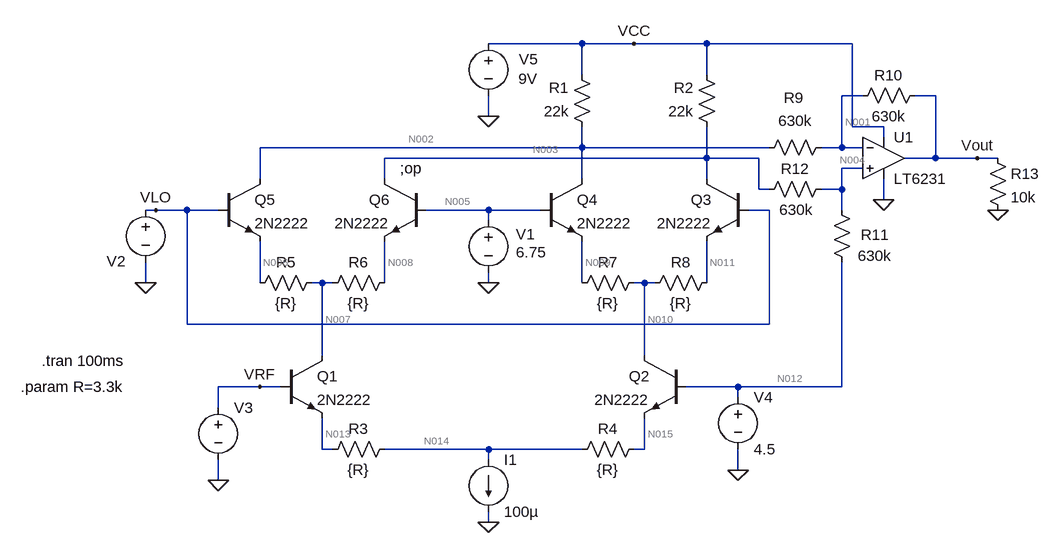
[diagram p0: schematic GilbertCellMultiplier.asc]
GilbertCellMultiplier.asc, the LTspice schematic file:
Version 4
SHEET 1 1116 680
WIRE 352 -416 208 -416
WIRE 432 -416 352 -416
WIRE 544 -416 432 -416
WIRE 768 -416 544 -416
WIRE 352 -368 352 -416
WIRE 544 -368 544 -416
WIRE 784 -336 752 -336
WIRE 896 -336 864 -336
WIRE 208 -304 208 -336
WIRE 768 -288 768 -416
WIRE 816 -288 768 -288
WIRE 816 -272 816 -288
WIRE 352 -256 352 -288
WIRE 352 -256 -144 -256
WIRE 640 -256 352 -256
WIRE 752 -256 752 -336
WIRE 752 -256 720 -256
WIRE 784 -256 752 -256
WIRE 544 -240 544 -288
WIRE 544 -240 48 -240
WIRE 624 -240 544 -240
WIRE 896 -240 896 -336
WIRE 896 -240 848 -240
WIRE 960 -240 896 -240
WIRE 992 -240 960 -240
WIRE 784 -224 752 -224
WIRE -144 -208 -144 -256
WIRE 48 -208 48 -240
WIRE 352 -208 352 -256
WIRE 544 -208 544 -240
WIRE 624 -192 624 -240
WIRE 640 -192 624 -192
WIRE 752 -192 752 -224
WIRE 752 -192 720 -192
WIRE 816 -176 816 -208
WIRE -304 -160 -320 -160
WIRE -256 -160 -304 -160
WIRE -208 -160 -256 -160
WIRE 208 -160 112 -160
WIRE 288 -160 208 -160
WIRE 640 -160 608 -160
WIRE 752 -160 752 -192
WIRE 208 -144 208 -160
WIRE -320 -48 -320 -80
WIRE -144 -48 -144 -112
WIRE -48 -48 -64 -48
WIRE -32 -48 -48 -48
WIRE 48 -48 48 -112
WIRE 208 -48 208 -64
WIRE 352 -48 352 -112
WIRE 448 -48 432 -48
WIRE 464 -48 448 -48
WIRE 544 -48 544 -112
WIRE -256 16 -256 -160
WIRE 640 16 640 -160
WIRE 640 16 -256 16
WIRE -48 64 -48 -48
WIRE 448 64 448 -48
WIRE -144 112 -208 112
WIRE -112 112 -144 112
WIRE 592 112 512 112
WIRE 752 112 752 -80
WIRE 752 112 592 112
WIRE 592 128 592 112
WIRE -208 144 -208 112
WIRE -48 208 -48 160
WIRE -32 208 -48 208
WIRE 208 208 48 208
WIRE 352 208 208 208
WIRE 448 208 448 160
WIRE 448 208 432 208
WIRE 208 224 208 208
WIRE 592 240 592 208
WIRE -208 256 -208 224
WIRE 208 320 208 304
FLAG 208 -48 0
FLAG -320 -48 0
FLAG -208 256 0
FLAG 592 240 0
FLAG 208 -304 0
FLAG 208 320 0
FLAG 816 -176 0
FLAG 960 -240 Vout
FLAG -304 -160 VLO
FLAG -144 112 VRF
FLAG 432 -416 VCC
FLAG 992 -160 0
SYMBOL npn -112 64 R0
SYMATTR InstName Q1
SYMATTR Value 2N2222
SYMBOL npn 512 64 M0
SYMATTR InstName Q2
SYMATTR Value 2N2222
SYMBOL npn 608 -208 M0
SYMATTR InstName Q3
SYMATTR Value 2N2222
SYMBOL npn 288 -208 R0
SYMATTR InstName Q4
SYMATTR Value 2N2222
SYMBOL npn -208 -208 R0
SYMATTR InstName Q5
SYMATTR Value 2N2222
SYMBOL npn 112 -208 M0
SYMATTR InstName Q6
SYMATTR Value 2N2222
SYMBOL res 368 -272 R180
WINDOW 0 36 76 Left 2
WINDOW 3 36 40 Left 2
SYMATTR InstName R1
SYMATTR Value 22k
SYMBOL res 560 -272 R180
WINDOW 0 36 76 Left 2
WINDOW 3 36 40 Left 2
SYMATTR InstName R2
SYMATTR Value 22k
SYMBOL res -48 224 R270
WINDOW 0 32 56 VTop 2
WINDOW 3 0 56 VBottom 2
SYMATTR InstName R3
SYMATTR Value {R}
SYMBOL res 336 224 R270
WINDOW 0 32 56 VTop 2
WINDOW 3 0 56 VBottom 2
SYMATTR InstName R4
SYMATTR Value {R}
SYMBOL res -160 -32 R270
WINDOW 0 32 56 VTop 2
WINDOW 3 0 56 VBottom 2
SYMATTR InstName R5
SYMATTR Value {R}
SYMBOL res -48 -32 R270
WINDOW 0 32 56 VTop 2
WINDOW 3 0 56 VBottom 2
SYMATTR InstName R6
SYMATTR Value {R}
SYMBOL res 336 -32 R270
WINDOW 0 32 56 VTop 2
WINDOW 3 0 56 VBottom 2
SYMATTR InstName R7
SYMATTR Value {R}
SYMBOL res 448 -32 R270
WINDOW 0 32 56 VTop 2
WINDOW 3 0 56 VBottom 2
SYMATTR InstName R8
SYMATTR Value {R}
SYMBOL voltage 208 -160 R0
WINDOW 0 42 37 Left 2
WINDOW 3 42 65 Left 2
WINDOW 123 0 0 Left 2
WINDOW 39 0 0 Left 2
SYMATTR InstName V1
SYMATTR Value 6.75
SYMBOL voltage -320 -176 R0
WINDOW 0 -60 95 Left 2
WINDOW 3 -140 252 Invisible 2
WINDOW 123 0 0 Left 2
WINDOW 39 -60 123 Left 2
SYMATTR InstName V2
SYMATTR Value SINE(6.75 100mV 10Hz)
SYMBOL voltage -208 128 R0
WINDOW 3 -377 96 Invisible 2
WINDOW 123 0 0 Left 2
WINDOW 39 0 0 Left 2
SYMATTR Value SINE(4.5V 200mV 440Hz 0 0 90)
SYMATTR InstName V3
SYMBOL voltage 592 112 R0
WINDOW 123 0 0 Left 2
WINDOW 39 0 0 Left 2
SYMATTR InstName V4
SYMATTR Value 4.5
SYMBOL voltage 208 -432 R0
WINDOW 0 47 40 Left 2
WINDOW 3 46 70 Left 2
WINDOW 123 0 0 Left 2
WINDOW 39 0 0 Left 2
SYMATTR InstName V5
SYMATTR Value 9V
SYMBOL current 208 224 R0
WINDOW 123 0 0 Left 2
WINDOW 39 0 0 Left 2
SYMATTR InstName I1
SYMATTR Value 100µ
SYMBOL Opamps\\LT6231 816 -240 R0
SYMATTR InstName U1
SYMBOL res 736 -272 R90
WINDOW 0 -45 58 VBottom 2
WINDOW 3 -41 56 VTop 2
SYMATTR InstName R9
SYMATTR Value 630k
SYMBOL res 880 -352 R90
WINDOW 0 0 56 VBottom 2
WINDOW 3 32 56 VTop 2
SYMATTR InstName R10
SYMATTR Value 630k
SYMBOL res 768 -64 R180
WINDOW 0 -57 58 Left 2
WINDOW 3 -61 26 Left 2
SYMATTR InstName R11
SYMATTR Value 630k
SYMBOL res 624 -176 R270
WINDOW 0 32 56 VTop 2
WINDOW 3 0 58 VBottom 2
SYMATTR InstName R12
SYMATTR Value 630k
SYMBOL res 976 -256 R0
SYMATTR InstName R13
SYMATTR Value 10k
TEXT -480 72 Left 2 !.tran 100ms
TEXT -512 112 Left 2 !.param R=3.3k
TEXT 72 -224 Left 2 !;op

The netlist it stands for:
* GilbertCellMultiplier.asc
Q1 N007 VRF N013 0 2N2222
Q2 N010 N012 N015 0 2N2222
Q3 N003 VLO N011 0 2N2222
Q4 N002 N005 N009 0 2N2222
Q5 N002 VLO N006 0 2N2222
Q6 N003 N005 N008 0 2N2222
R1 N002 VCC 22k
R2 N003 VCC 22k
R3 N013 N014 {R}
R4 N014 N015 {R}
R5 N006 N007 {R}
R6 N007 N008 {R}
R7 N009 N010 {R}
R8 N010 N011 {R}
V1 N005 0 6.75
V2 VLO 0 SINE(6.75 100mV 10Hz)
V3 VRF 0 SINE(4.5V 200mV 440Hz 0 0 90)
V4 N012 0 4.5
V5 VCC 0 9V
I1 N014 0 100µ
XU1 N004 N001 Vout VCC 0 LT6231  ; pins In+ In- OUT V+ V-
R9 N001 N002 630k
R10 Vout N001 630k
R11 N012 N004 630k
R12 N003 N004 630k
R13 Vout 0 10k
.model NPN NPN
.model PNP PNP
.lib standard.bjt
.tran 100ms
.param R=3.3k
;op
.lib LTC2.lib
.backanno
.end

* Results of the author's LTspice run, read from the files saved beside the schematic
* Operating Point, zero values left out:
*   V(n007) = 6.056 V
*   V(vrf) = 4.7 V
*   V(n013) = 4.112 V
*   V(n010) = 6.17 V
*   V(n012) = 4.5 V
*   V(n015) = 3.942 V
*   V(n003) = 7.798 V
*   V(vlo) = 6.75 V
*   V(n011) = 6.21 V
*   V(n002) = 7.798 V
*   V(n005) = 6.75 V
*   V(n009) = 6.21 V
*   V(n006) = 6.18 V
*   V(n008) = 6.18 V
*   V(vcc) = 9 V
*   V(n014) = 3.862 V
*   V(n001) = 4.572 V
*   V(n004) = 4.572 V
*   V(vout) = 4.498 V
*   Ic(Q6) = 37.53 µA
*   Ib(Q6) = 185.7 nA
*   Ie(Q6) = -37.72 µA
*   Ic(Q5) = 37.53 µA
*   Ib(Q5) = 185.7 nA
*   Ie(Q5) = -37.72 µA
*   Ic(Q4) = 11.98 µA
*   Ib(Q4) = 59.26 nA
*   Ie(Q4) = -12.04 µA
*   Ic(Q3) = 11.98 µA
*   Ib(Q3) = 59.26 nA
*   Ie(Q3) = -12.04 µA
*   Ic(Q2) = 24.07 µA
*   Ib(Q2) = 118.4 nA
*   Ie(Q2) = -24.19 µA
*   Ic(Q1) = 75.44 µA
*   Ib(Q1) = 372.2 nA
*   Ie(Q1) = -75.81 µA
*   I(I1) = 100 µA
*   I(R13) = 449.8 µA
*   I(R12) = 5.12 µA
*   I(R11) = -114.7 nA
*   I(R10) = -117.5 nA
*   I(R9) = -5.12 µA
*   I(R8) = -12.04 µA
*   I(R7) = 12.04 µA
*   I(R6) = -37.72 µA
*   I(R5) = 37.72 µA
*   I(R4) = -24.19 µA
*   I(R3) = 75.81 µA
*   I(R2) = -54.63 µA
*   I(R1) = -54.63 µA
*   I(V5) = -3.465 mA
*   I(V4) = -3.702 nA
*   I(V3) = -372.2 nA
*   I(V2) = -245 nA
*   I(V1) = -245 nA
*   Ix(u1:1) = 5.006 µA
*   Ix(u1:2) = 5.003 µA
*   Ix(u1:3) = -449.7 µA
*   Ix(u1:4) = 3.356 mA
*   Ix(u1:5) = -2.916 mA
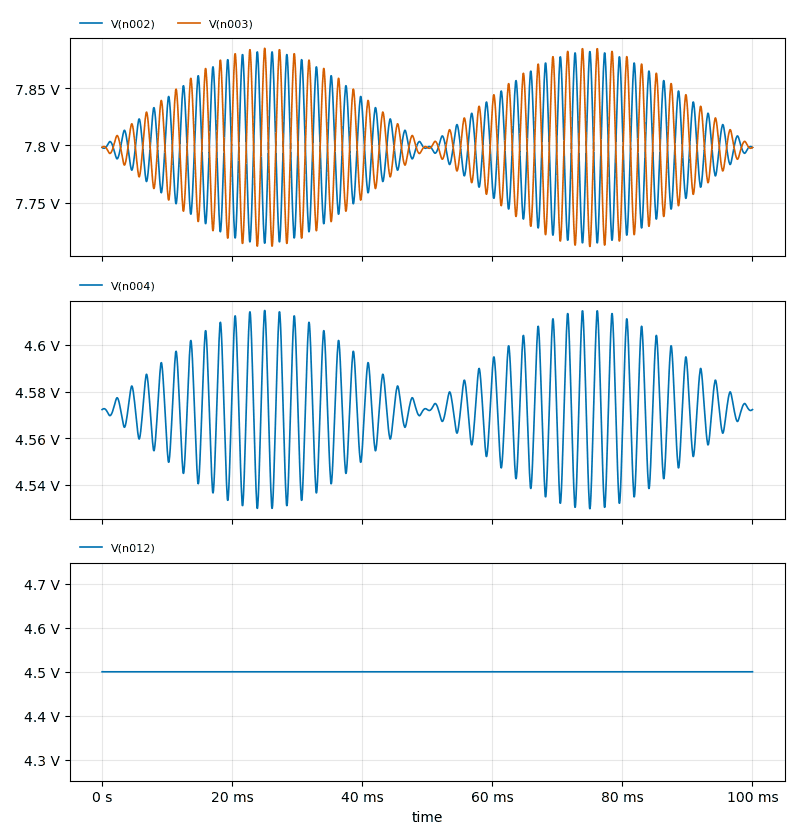
[diagram p1: Transient Analysis of GilbertCellMultiplier.asc, plotted from the saved traces]
* Transient Analysis, 1 run:
*   V(n002): min 7.715 V, max 7.882 V, average 7.798 V, rms 7.798 V, last 7.798 V
*   V(n003): min 7.712 V, max 7.885 V, average 7.798 V, rms 7.798 V, last 7.798 V
*   V(n004): min 4.53 V, max 4.615 V, average 4.572 V, rms 4.572 V, last 4.572 V
*   V(n012): min 4.5 V, max 4.5 V, average 4.5 V, rms 4.5 V, last 4.5 V